# Altium project led_matrix_board.PrjPcb
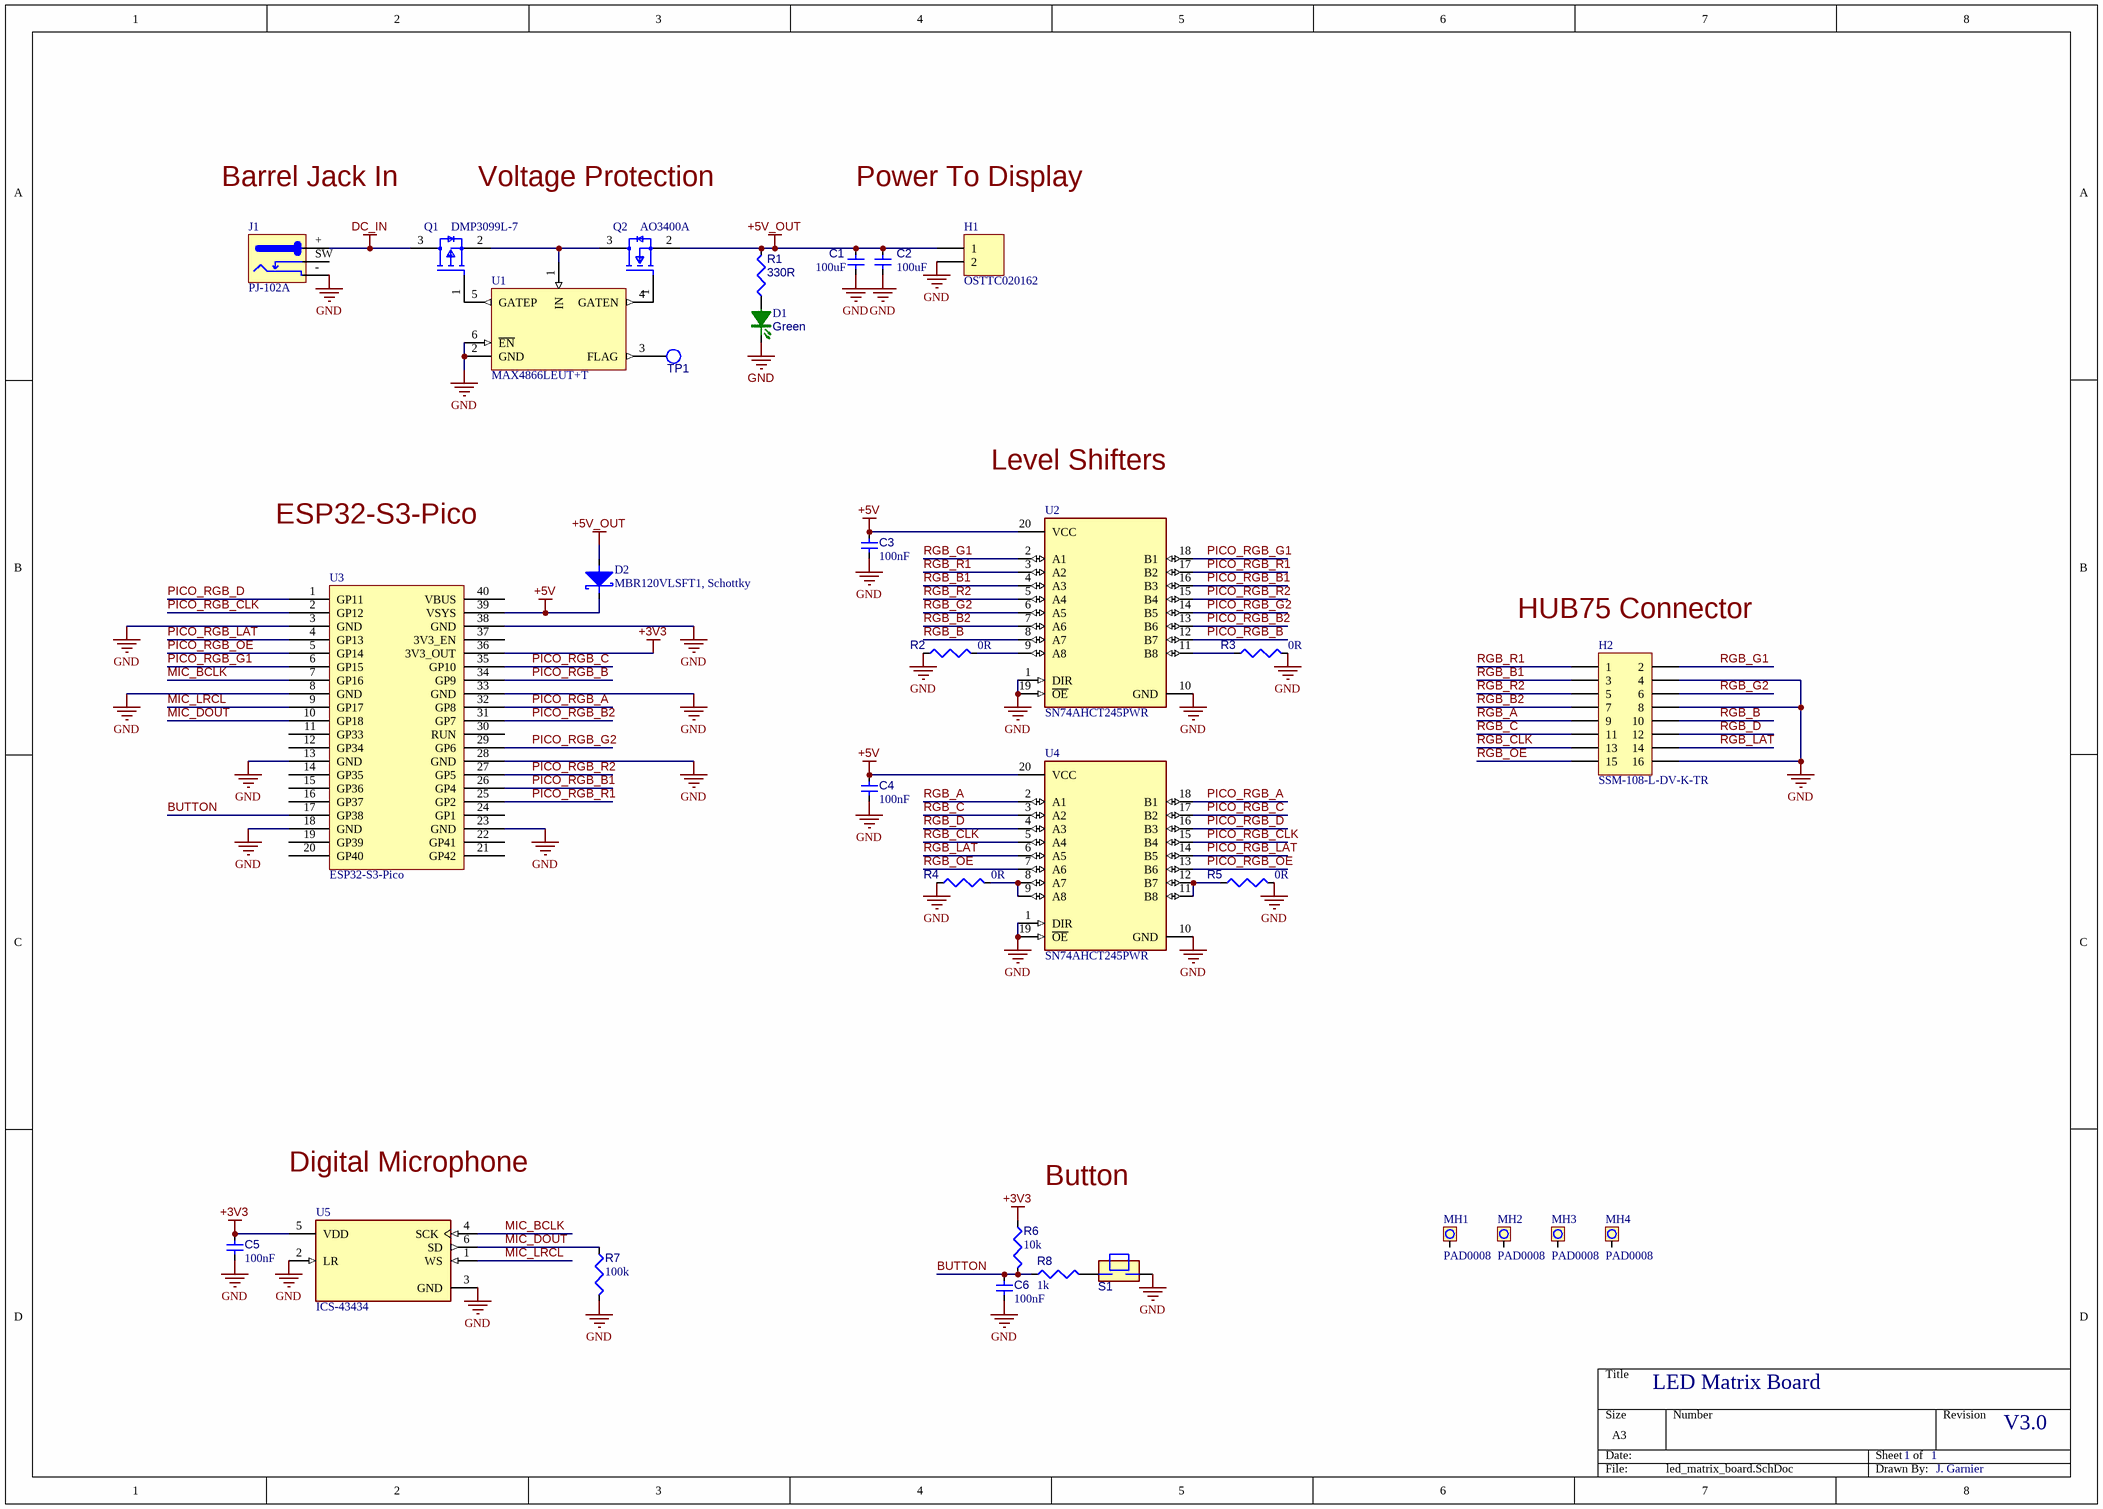
[diagram p0: led_matrix_board.SchDoc]
Rev: 3.0; Project: LED Matrix Board; Author: Jonathan Garnier
1 sheet, 32 parts. Net scope: global (net labels, ports and power ports of the same name join across sheets).
Board file: led_matrix_board.PcbDoc

## Sheet led_matrix_board.SchDoc: LED Matrix Board
size A3; DrawnBy: J. Garnier; Revision: 3.0; SheetNumber: 1; SheetTotal: 1; PageSetup: Record=PageOptions|CenterHorizontal=True|CenterVertical=True|PrintScale=1.04|XCorrection=1.00|YCorrection=1.00|PrintKind=0|BorderSize=5000000|LeftOffset=0|BottomOffset=0|Orientation=2|PaperLength=1000|PaperWidth=1000|Scale=100|PaperSource=7|PrintQuality=-4|MediaType=1|DitherType=10|PaperKind=A3|PrintScaleMode=1

### Parts
C1  value 100uF  [CAPC3225X20N]  (hidden comment: CL32A107MPVNNNE)
C2  value 100uF  [CAPC3225X20N]  (hidden comment: CL32A107MPVNNNE)
C3  value 100nF  [0603_cap]  (hidden comment: C0603C104K8RACTU)
C4  value 100nF  [0603_cap]  (hidden comment: C0603C104K8RACTU)
C5  value 100nF  [0603_cap]  (hidden comment: C0603C104K8RACTU)
C6  value 100nF  [0603_cap]  (hidden comment: C0603C104K8RACTU)
D1  value Green  [LED_0402_GREEN]  (hidden comment: XZVGR68W-3)
D2  value MBR120VLSFT1, Schottky  [SOD-123FL]  (hidden comment: MBR120VLSFT1)
H1  OSTTC020162  [SCREW_TERM_2WAY_5MM]
H2  SSM-108-L-DV-K-TR  [FP-SSM-108-L-DV-K-TR-MFG]
J1  PJ-102A  [PJ-102A]
MH1  PAD0008  [MH_600_320_NPTH]
MH2  PAD0008  [MH_600_320_NPTH]
MH3  PAD0008  [MH_600_320_NPTH]
MH4  PAD0008  [MH_600_320_NPTH]
Q1  DMP3099L-7  [FP-SOT23-IPC_C]
Q2  AO3400A  [FP-SOT23-IPC_C]
R1  value 330R  [0402_res]  (hidden comment: MCR01MZPF3300)
R2  value 0R  [0603_res]  (hidden comment: ERJ-3GEY0R00V)
R3  value 0R  [0603_res]  (hidden comment: ERJ-3GEY0R00V)
R4  value 0R  [0603_res]  (hidden comment: ERJ-3GEY0R00V)
R5  value 0R  [0603_res]  (hidden comment: ERJ-3GEY0R00V)
R6  value 10k  [0603_res]  (hidden comment: 0603WAF1002T5E)
R7  value 100k  [0603_res]  (hidden comment: 0603WAF1003T5E)
R8  value 1k  [0603_res]  (hidden comment: ERA-3AEB102V)
S1  EVQ-PF206K  [EVQ-PF206K]  (value not drawn)
TP1  PAD0035  [TP_40_SMT]  (value not drawn)  (no BOM)
U1  MAX4866LEUT+T  [MAX4866LEUT+T-Footprint-1]
U2  SN74AHCT245PWR  [FP-PW0020A-IPC_A]
U3  ESP32-S3-Pico  [ESP32-S3-Pico]
U4  SN74AHCT245PWR  [FP-PW0020A-IPC_A]
U5  ICS-43434  [FP-ICS-43434-MFG]

### Nets
+3V3: C5.1 R6.1 U3.36(3V3_OUT) U5.5(VDD)
+5V: C3.1 C4.1 D2.K U2.20(VCC) U3.39(VSYS) U4.20(VCC)
+5V_OUT: C1.1 C2.1 D2.A H1.1 Q2.2(S) R1.2
DC_IN: J1.+ Q1.3(D)
GND: C1.2 C2.2 C3.2 C4.2 C5.2 C6.2 D1.K H1.2 H2.4 H2.8 H2.16 J1.- R2.1 R3.1 R4.1 R5.2 R7.2 S1.2 U1.2(GND) U1.6(~{EN}) U2.1(DIR) U2.10(GND) U2.19(~{OE}) U3.3(GND) U3.8(GND) U3.13(GND) U3.18(GND) U3.23(GND) U3.28(GND) U3.33(GND) U3.38(GND) U4.1(DIR) U4.10(GND) U4.19(~{OE}) U5.2(LR) U5.3(GND)
BUTTON: C6.1 R6.2 R8.1 U3.17(GP38)
MIC_BCLK: U3.7(GP16) U5.4(SCK)
MIC_DOUT: R7.1 U3.10(GP18) U5.6(SD)
MIC_LRCL: U3.9(GP17) U5.1(WS)
PICO_RGB_A: U3.32(GP8) U4.18(B1)
PICO_RGB_B: U2.12(B7) U3.34(GP9)
PICO_RGB_B1: U2.16(B3) U3.26(GP4)
PICO_RGB_B2: U2.13(B6) U3.31(GP7)
PICO_RGB_C: U3.35(GP10) U4.17(B2)
PICO_RGB_CLK: U3.2(GP12) U4.15(B4)
PICO_RGB_D: U3.1(GP11) U4.16(B3)
PICO_RGB_G1: U2.18(B1) U3.6(GP15)
PICO_RGB_G2: U2.14(B5) U3.29(GP6)
PICO_RGB_LAT: U3.4(GP13) U4.14(B5)
PICO_RGB_OE: U3.5(GP14) U4.13(B6)
PICO_RGB_R1: U2.17(B2) U3.25(GP2)
PICO_RGB_R2: U2.15(B4) U3.27(GP5)
RGB_A: H2.9 U4.2(A1)
RGB_B: H2.10 U2.8(A7)
RGB_B1: H2.3 U2.4(A3)
RGB_B2: H2.7 U2.7(A6)
RGB_C: H2.11 U4.3(A2)
RGB_CLK: H2.13 U4.5(A4)
RGB_D: H2.12 U4.4(A3)
RGB_G1: H2.2 U2.2(A1)
RGB_G2: H2.6 U2.6(A5)
RGB_LAT: H2.14 U4.6(A5)
RGB_OE: H2.15 U4.7(A6)
RGB_R1: H2.1 U2.3(A2)
RGB_R2: H2.5 U2.5(A4)
NetD1_A: D1.A R1.1
NetQ1_1: Q1.1(G) U1.5(GATEP)
NetQ1_2: Q1.2(S) Q2.3(D) U1.1(IN)
NetQ2_1: Q2.1(G) U1.4(GATEN)
NetR2_2: R2.2 U2.9(A8)
NetR3_2: R3.2 U2.11(B8)
NetR4_2: R4.2 U4.8(A7) U4.9(A8)
NetR5_1: R5.1 U4.11(B8) U4.12(B7)
NetR8_2: R8.2 S1.1
NetTP1_1: TP1.1 U1.3(FLAG)

Not connected (* = marked no-connect by the designer): J1 SW; MH1 1; MH2 1; MH3 1; MH4 1; U3 11(GP33) 12(GP34) 14(GP35) 15(GP36) 16(GP37) 19(GP39) 20(GP40) 21(GP42) 22(GP41) 24(GP1) 30(RUN) 37(3V3_EN) 40(VBUS)

### Notes on the sheet
- Barrel Jack In
- Voltage Protection
- Power To Display
- Level Shifters
- ESP32-S3-Pico
- (near H2) HUB75 Connector
- Digital Microphone
- (near R6) Button
- LED Matrix Board
- 1
- V3.0
- J. Garnier
- Level 8, 10-14 Waterloo Street
- Surry Hills, NSW 2010
- Drawn:
- Checked:
- Morse Micro
- Title
- AUSTRALIA
- (c) Copyright 2024
- Approved:
- Date Released:
- Drawing No:
- PCBA No:
- Drawing
- Revision:
- Size:
- A3
- File:
- Sheet
- of

### Library data of the parts
C1 C2 = CAP0047-3: CAP CER 100UF 10V ±20% X5R 1210; Generic Allowed: Yes; Subtype: Ceramic; Component Rating: X5R; Package: 1210; Tolerance: 20%; ClassName: CHIP_OTHER; Voltage: 10V
C3-C6 = CAP0030-8: CAP CER 100NF 10V ±10% X7R 0603; Generic Allowed: Yes; Subtype: Ceramic; Tolerance: 10%; ClassName: CHIP_OTHER; Package: 0603; Voltage: 10V; Component Rating: X7R
D1 = DIO0053-6: LED GREEN 0402 SMD; Generic Allowed: Yes; Voltage: 2.0V; ClassName: CHIP_OTHER; Package: 0402
D2 = DIO0005-3: Diodes, MBR120VLSFT1 Schottky 1A 20V, Vf=0.34V; Generic Allowed: No; ClassName: COMP_OTHER; Component Rating: Vf=0.34V; Voltage: 20V; Current: 1A; Package: SOD-123FL
H1 = JCK0020-1: CONN TERM BLOCK 5MM 2POS; Generic Allowed: Yes; ClassName: COMP_OTHER; Package: THRU-Hole
H2 = HDR0162-1: PCB Receptacle, Board-to-Board, 2.54 mm, 2 Rows, 16 Contacts, Surface Mount; Manufacturer Lifecycle Status: PRODUCTION; Number of Positions: 16; Voltage Rating: 572V; Connector Type: Header, Socket; Pitch: 2.54mm; Dielectric Material: Polyamide; Current Rating: 5.2A; Contact Gender: Female; Min Operating Temperature: -55°C; Gender: Receptacle; Housing Material: Nylon; Housing Color: Black; Termination: Solder; Number of Rows: 2; Packaging: Tape and Reel; REACH SVHC: No; Height: 7.46mm; Number of Contacts: 16; Terminal Pitch: 2.54mm; Length: 20.8mm; Row Spacing: 2.54mm; Lead Free: Lead Free; Pins: 16; RoHS: Compliant; Mounting Technology: Surface Mount; Max Operating Temperature: 125°C; Lifecycle Status: Production; Color: Black; Width: 5mm; Contact Material: Gold, Nickel; Contact Plating: Gold
J1 = JCK0011-1: Conn Power Jack 2.1mm PCB Mount Thru-Hole; Generic Allowed: No; ClassName: COMP_OTHER; Package: THRU-Hole
MH1-MH4 = PAD0008-2: MH 6.00MM DIA 3.2MM HOLE NPTH; Shape: Round; ClassName: PCB_PATTERN
Q1 = TSR0027-1: DMP3099L Series 30 V 65 mOhm P-Channel Enhancement Mode Mosfet - SOT-23-3; Threshold Voltage: -2.1V; Drain to Source Voltage (Vdss): -30V; Power Dissipation: 1.08W; Rise Time: 5ns; Max Junction Temperature (Tj): 150°C; Fall Time: 15ns; Turn-On Delay Time: 4.8ns; Input Capacitance: 563pF; Turn-Off Delay Time: 31ns; Number of Channels: 1; Rds On Max: 65mΩ; Element Configuration: Single; Gate to Source Voltage (Vgs): 20V; Min Breakdown Voltage: 30V; Continuous Drain Current (ID): 3.8A; RoHS: Compliant; Schedule B: 8541290080, 8541290080; Pins: 3; China RoHS: Compliant; Min Operating Temperature: -55°C; Introduction Date: 2013-05-28; Lead Free: Lead Free; Drain to Source Breakdown Voltage: -30V; REACH SVHC: Yes; Contact Plating: Tin; Max Power Dissipation: 1.08W; Number of Elements: 1; Radiation Hardening: No; Drain to Source Resistance: 65mΩ; Height: 1.1mm; Lifecycle Status: Production; Case/Package: SOT-23; Number of Terminals: 3; Mounting Technology: Surface Mount; Weight: 7.994566mg; Length: 3mm; Width: 1.4mm; Max Operating Temperature: 150°C; Export Control Classification Number (ECCN) Code: EAR99
Q2 = TSR0028-1: Trans MOSFET N-CH 30V 5.7A 3-Pin SOT-23; Drain to Source Resistance: 26.5mΩ; Gate to Source Voltage (Vgs): 12V; Input Capacitance: 630pF; Number of Elements: 1; Turn-On Delay Time: 3ns; Turn-Off Delay Time: 25ns; Threshold Voltage: 650mV; Power Dissipation: 1.4W; Max Junction Temperature (Tj): 150°C; Drain to Source Voltage (Vdss): 30V; Number of Terminals: 3; Mounting Technology: Surface Mount; Continuous Drain Current (ID): 5.7A; Drain to Source Breakdown Voltage: 30V; Pins: 3; Min Operating Temperature: -55°C; Height: 1.25mm; Radiation Hardening: No; Export Control Classification Number (ECCN) Code: EAR99; Max Operating Temperature: 150°C; Schedule B: 8541290080, 8541290080; Introduction Date: 2007-04-17; Lifecycle Status: Production; Number of Channels: 1; RoHS: Compliant; Rds On Max: 26.5mΩ; Max Power Dissipation: 1.4W; REACH SVHC: Yes; Lead Free: Lead Free; Min Breakdown Voltage: 30V; Case/Package: SOT-23
R1 = RES0073-11: RES SMD 330R OHM ±1% 1/16W 0402; Generic Allowed: Yes; ClassName: CHIP_MICRO; Package: 0402; Power: 1/16W; Tolerance: 1%
R2-R5 = RES0003-8: RES SMD 0R OHM ±1% 1/10W 0603; Generic Allowed: Yes; Package: 0603; Tolerance: 1%; Power: 1/10W; ClassName: CHIP_MICRO
R6 = RES0219-8: RES SMD 10K OHM ±1% 1/10W 0603; Generic Allowed: Yes; Subtype: Thick Film; Power: 1/10W; Tolerance: 1%; Package: 0603; ClassName: CHIP_MICRO
R7 = RES0224-8: RES SMD 100K OHM ±1% 1/10W 0603; Subtype: Thick Film; Generic Allowed: Yes; ClassName: CHIP_MICRO; Power: 1/10W; Package: 0603; Tolerance: 1%
R8 = RES0105-8: RES SMD 1K OHM ±0 .1% 1/10W 0603; Tolerance: 0 .1%; Generic Allowed: Yes; Power: 1/10W; ClassName: CHIP_OTHER; Package: 0603
S1 = SWH0003-1: SW, Tactile 15V@20mA, EVQ-PF, Through Hole, R/A, 7.5x7.1x5.85mm; Generic Allowed: Yes; ClassName: COMP_OTHER; Package: EVQ-PF206K
TP1 = PAD0035-2: 40mil 1mm SMD Test Point; Shape: Round; ClassName: PCB_PATTERN
U1 = ICT0297-2: Overvoltage Protection Controllers with Reverse Polarity Protection; Manufacturer Lifecycle Status: PRODUCTION; Nominal Supply Current: 77µA; Number of Outputs: 1; Max Junction Temperature (Tj): 150°C; Min Supply Voltage: 1.2V; Max Supply Voltage: 28V; Max Power Dissipation: 696mW; Pins: 6; Lifecycle Status: Production; RoHS: Compliant; Max Operating Temperature: 85°C; Min Operating Temperature: -40°C; Height: 1.45mm; Mounting Technology: Surface Mount; Number of Channels: 1; Radiation Hardening: No; Case/Package: SOT-23
U2 U4 = ICT0294-1: 8mA 8 4.5V~5.5V 8mA 1 TSSOP-20 Buffer/Driver/Transceiver ROHS; Manufacturer Lifecycle Status: ACTIVE; Quiescent Current: 4µA; Direction: Bidirectional; Operating Supply Voltage: 5V; Polarity: Non-Inverting; Number of Bits per Element: 8; Number of Elements: 1; Propagation Delay: 5.3ns; Max Supply Voltage: 5.5V; Turn-On Delay Time: 16.5ns; High Level Output Current: -8mA; Min Supply Voltage: 4.5V; Logic Function: Inverting, Transceiver; Thickness: 1mm; Pins: 20; Radiation Hardening: No; Lifecycle Status: Production; Number of Bits: 8; Max Operating Temperature: 125°C; RoHS: Compliant; Nominal Supply Current: 4µA; Case/Package: TSSOP; Number of Channels: 8; Height: 0m; Mounting Technology: Surface Mount; Width: 4.4mm; Number of Inputs: 8; Number of Outputs: 8; Min Operating Temperature: -40°C; Schedule B: 8542390000, 8542390000; Weight: 76.997305mg; REACH SVHC: No; Ambient Temperature Range High: 125°C; Lead Free: Lead Free; Number of Circuits: 1; Low Level Output Current: 8mA; Length: 6.5mm; Contact Plating: Gold
U3 = MOD0041-1: ESP32-S3-Pico Module.
U5 = CMP-00035-1: Mic Omni-Directional -26dB 3.63V Rectangular Solder Pad T/R; Operating Supply Current: 550µA; Min Supply Voltage: 1.65V; Direction: Omnidirectional; Output Type: Digital; Min Operating Temperature: -40°C; Min Thickness: 880µm; Max Length: 3.6mm; Max Operating Temperature: 85°C; Max Thickness: 1.08mm; Min Length: 3.4mm; Width: 2.65mm; Schedule B: 8518100000, 8518100000; Min Width: 2.55mm; Lifecycle Status: Production; Max Supply Voltage: 3.63V; RoHS: Compliant; Length: 3.5mm; Height: 980µm; Max Width: 2.75mm

## Assembly variants
Default Build: all parts fitted